# EAGLE design mosfet (EAGLE 5.11)
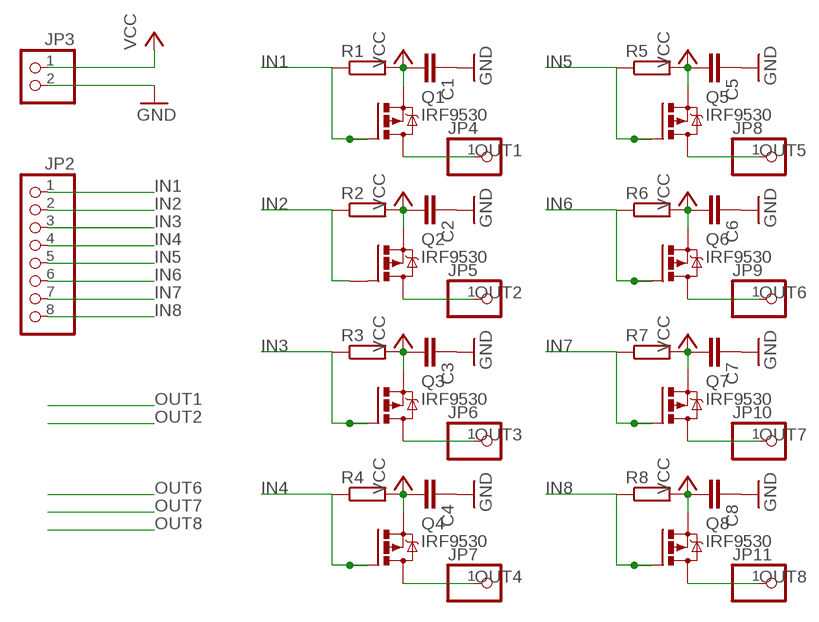
[diagram p0: schematic, sheet 1]

## Parts
C1  C-EU025-025X050  [C025-025X050]
C2  C-EU025-025X050  [C025-025X050]
C3  C-EU025-025X050  [C025-025X050]
C4  C-EU025-025X050  [C025-025X050]
C5  C-EU025-025X050  [C025-025X050]
C6  C-EU025-025X050  [C025-025X050]
C7  C-EU025-025X050  [C025-025X050]
C8  C-EU025-025X050  [C025-025X050]
JP2  PINHD-1X8  [1X08]
JP3  PINHD-1X2  [1X02]
JP4  PINHD-1X1  [1X01]
JP5  PINHD-1X1  [1X01]
JP6  PINHD-1X1  [1X01]
JP7  PINHD-1X1  [1X01]
JP8  PINHD-1X1  [1X01]
JP9  PINHD-1X1  [1X01]
JP10  PINHD-1X1  [1X01]
JP11  PINHD-1X1  [1X01]
Q1  IRF9530  [TO220BV]
Q2  IRF9530  [TO220BV]
Q3  IRF9530  [TO220BV]
Q4  IRF9530  [TO220BV]
Q5  IRF9530  [TO220BV]
Q6  IRF9530  [TO220BV]
Q7  IRF9530  [TO220BV]
Q8  IRF9530  [TO220BV]
R1  R-EU_0207/2V  [0207/2V]
R2  R-EU_0207/2V  [0207/2V]
R3  R-EU_0207/2V  [0207/2V]
R4  R-EU_0207/2V  [0207/2V]
R5  R-EU_0207/2V  [0207/2V]
R6  R-EU_0207/2V  [0207/2V]
R7  R-EU_0207/2V  [0207/2V]
R8  R-EU_0207/2V  [0207/2V]

## Nets
GND: C1.1 C2.1 C3.1 C4.1 C5.1 C6.1 C7.1 C8.1 JP3.2
IN1: JP2.1 Q1.G R1.1
IN2: JP2.2 Q2.G R2.1
IN3: JP2.3 Q3.G R3.1
IN4: JP2.4 Q4.G R4.1
IN5: JP2.5 Q5.G R5.1
IN6: JP2.6 Q6.G R6.1
IN7: JP2.7 Q7.G R7.1
IN8: JP2.8 Q8.G R8.1
OUT1: JP4.1 Q1.D
OUT2: JP5.1 Q2.D
OUT3: JP6.1 Q3.D
OUT4: JP7.1 Q4.D
OUT5: JP8.1 Q5.D
OUT6: JP9.1 Q6.D
OUT7: JP10.1 Q7.D
OUT8: JP11.1 Q8.D
VCC: C1.2 C2.2 C3.2 C4.2 C5.2 C6.2 C7.2 C8.2 JP3.1 Q1.S Q2.S Q3.S Q4.S Q5.S Q6.S Q7.S Q8.S R1.2 R2.2 R3.2 R4.2 R5.2 R6.2 R7.2 R8.2

## Library data of the parts
C1-C8 = rcl:C-EU: CAPACITOR, European symbol
JP2 = pinhead:PINHD-1X8: PIN HEADER
JP3 = pinhead:PINHD-1X2: PIN HEADER
JP4-JP11 = pinhead:PINHD-1X1: PIN HEADER
Q1-Q8 = transistor-power:IRF9530: P-CHANNEL HEXFET POWER-MOS-FET Source: http://www.irf.com/product-info/datasheets/data/irf9530.pdf
R1-R8 = rcl:R-EU_: RESISTOR, European symbol

## Board
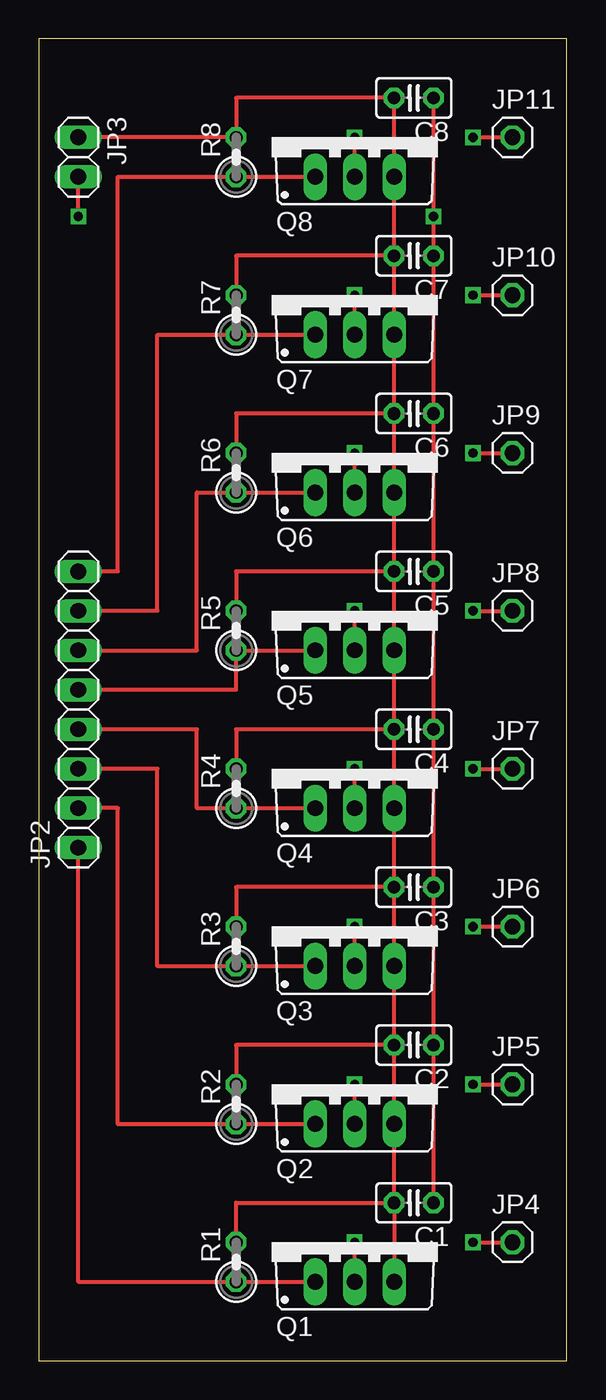
[diagram p1: board, top side]
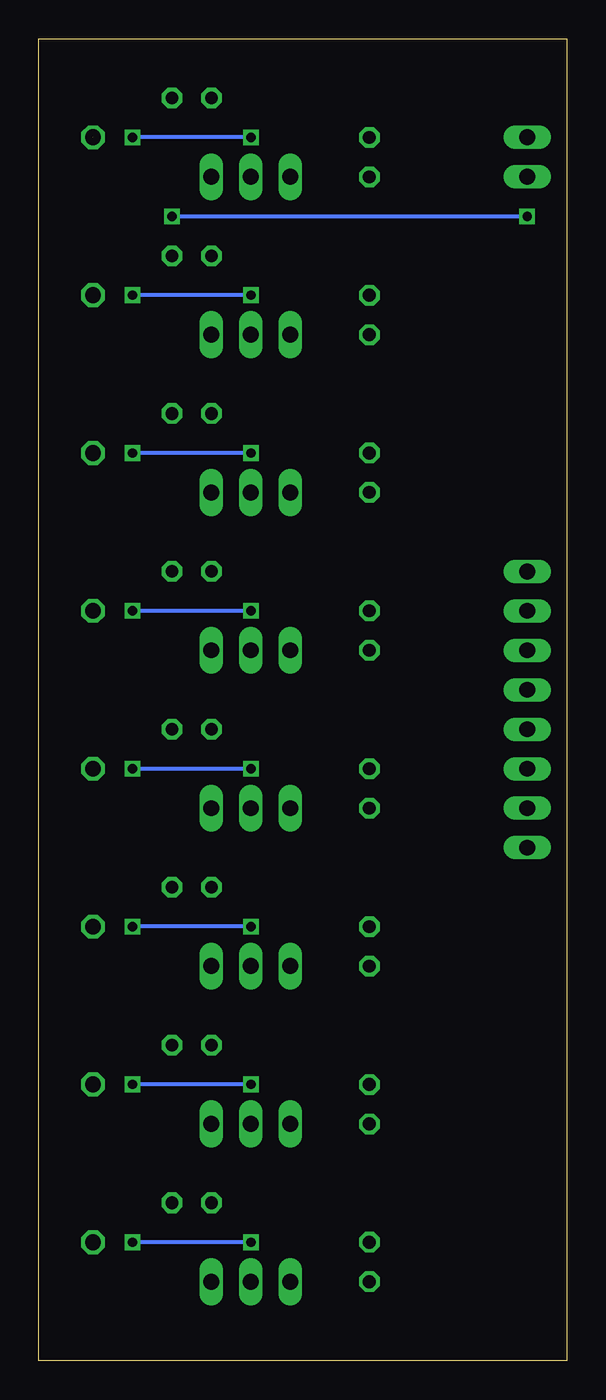
[diagram p2: board, bottom side, seen from below]

Size 33.96 x 85.08 mm. Coordinates in mm from the lower left corner, seen from the top.
Outline: 0,0 33.96,0 33.96,85.08 0,85.08 0,0
Copper layers (1*16): Top 0.035mm / dielectric 1.5mm / Bottom 0.035mm
Design rules "default": minimum track width 10mil, minimum drill 24mil, track to track 8mil, track to pad 8mil, pad to pad 8mil, via to via 8mil, smd to smd 8mil, copper to edge 40mil, drill to drill 8mil, minimum pad ring 10mil, minimum via ring 8mil, stop-mask expansion 4mil, vias tented up to drill 0mil, thermal gap 10mil

### Footprints (pad centres in the part's own frame; a part is rotated, then mirrored left to right if it is on the bottom)
C025-025X050 = drill 0.813 octagon: 1 -1.27,0; 2 1.27,0
1X08 = drill 1.016 long: 1 -8.89,0; 2 -6.35,0; 3 -3.81,0; 4 -1.27,0; 5 1.27,0; 6 3.81,0; 7 6.35,0; 8 8.89,0
1X02 = drill 1.016 long: 1 -1.27,0; 2 1.27,0
1X01 = drill 1.016 octagon: 1 0,0
TO220BV = drill 1.016 long: D 0,-2.54; G -2.54,-2.54; S 2.54,-2.54
0207/2V = drill 0.813 octagon: 1 -1.27,0; 2 1.27,0

### Placement (x,y rotation side)
C1  24.13,10.16 180 top
C2  24.13,20.32 180 top
C3  24.13,30.48 180 top
C4  24.13,40.64 180 top
C5  24.13,50.8 180 top
C6  24.13,60.96 180 top
C7  24.13,71.12 180 top
C8  24.13,81.28 180 top
JP2  2.54,41.91 90 top
JP3  2.54,77.47 270 top
JP4  30.48,7.62 0 top
JP5  30.48,17.78 0 top
JP6  30.48,27.94 0 top
JP7  30.48,38.1 0 top
JP8  30.48,48.26 0 top
JP9  30.48,58.42 0 top
JP10  30.48,68.58 0 top
JP11  30.48,78.74 0 top
Q1  20.32,7.62 0 top
Q2  20.32,17.78 0 top
Q3  20.32,27.94 0 top
Q4  20.32,38.1 0 top
Q5  20.32,48.26 0 top
Q6  20.32,58.42 0 top
Q7  20.32,68.58 0 top
Q8  20.32,78.74 0 top
R1  12.7,6.35 90 top
R2  12.7,16.51 90 top
R3  12.7,26.67 90 top
R4  12.7,36.83 90 top
R5  12.7,46.99 90 top
R6  12.7,57.15 90 top
R7  12.7,67.31 90 top
R8  12.7,77.47 90 top

### Tracks (layer width: path | path; a pad name or v marks a point on that pad's centre or on a via)
GND  (via drill 0.6)
  Top 0.254: C1.1 C2.1 C3.1 C4.1 C5.1 C6.1 C7.1 v25.4,73.66 C8.1 | v2.54,73.66 JP3.2
  Bottom 0.254: v25.4,73.66 v2.54,73.66
IN1
  Top 0.254: Q1.G R1.1 2.54,5.08 JP2.1
IN2
  Top 0.254: Q2.G R2.1 5.08,15.24 5.08,35.56 JP2.2
IN3
  Top 0.254: Q3.G R3.1 7.62,25.4 7.62,38.1 JP2.3
IN4
  Top 0.254: Q4.G R4.1 10.16,35.56 10.16,40.64 JP2.4
IN5
  Top 0.254: Q5.G R5.1 12.7,43.18 JP2.5
IN6
  Top 0.254: Q6.G R6.1 10.16,55.88 10.16,45.72 JP2.6
IN7
  Top 0.254: Q7.G R7.1 7.62,66.04 7.62,48.26 JP2.7
IN8
  Top 0.254: Q8.G R8.1 5.08,76.2 5.08,50.8 JP2.8
OUT1  (via drill 0.6)
  Top 0.254: Q1.D v20.32,7.62 | v27.94,7.62 JP4.1
  Bottom 0.254: v20.32,7.62 v27.94,7.62
OUT2  (via drill 0.6)
  Top 0.254: Q2.D v20.32,17.78 | v27.94,17.78 JP5.1
  Bottom 0.254: v20.32,17.78 v27.94,17.78
OUT3  (via drill 0.6)
  Top 0.254: Q3.D v20.32,27.94 | v27.94,27.94 JP6.1
  Bottom 0.254: v20.32,27.94 v27.94,27.94
OUT4  (via drill 0.6)
  Top 0.254: Q4.D v20.32,38.1 | v27.94,38.1 JP7.1
  Bottom 0.254: v20.32,38.1 v27.94,38.1
OUT5  (via drill 0.6)
  Top 0.254: Q5.D v20.32,48.26 | v27.94,48.26 JP8.1
  Bottom 0.254: v20.32,48.26 v27.94,48.26
OUT6  (via drill 0.6)
  Top 0.254: Q6.D v20.32,58.42 | v27.94,58.42 JP9.1
  Bottom 0.254: v20.32,58.42 v27.94,58.42
OUT7  (via drill 0.6)
  Top 0.254: Q7.D v20.32,68.58 | v27.94,68.58 JP10.1
  Bottom 0.254: v20.32,68.58 v27.94,68.58
OUT8  (via drill 0.6)  (1 unrouted)
  Top 0.254: Q8.D v20.32,78.74 | v27.94,78.74 JP11.1
  Bottom 0.254: v20.32,78.74 v27.94,78.74
VCC
  Top 0.254: C7.2 Q7.S C6.2 | C7.2 Q8.S C8.2 12.7,81.28 R8.2 JP3.1 | C6.2 Q6.S C5.2 | C5.2 Q5.S C4.2 | C4.2 Q4.S C3.2 | C3.2 Q3.S C2.2 | C2.2 Q2.S C1.2 | C1.2 Q1.S | R7.2 12.7,71.12 C7.2 | R6.2 12.7,60.96 C6.2 | R5.2 12.7,50.8 C5.2 | R4.2 12.7,40.64 C4.2 | R3.2 12.7,30.48 C3.2 | R2.2 12.7,20.32 C2.2 | R1.2 12.7,10.16 C1.2